# Altium schematic sheet Buffer.SchDoc: Buffer
size A4; Author: -; CompanyName: IOElectro; DrawnBy: Esmaeill M; Engineer: -; Organization: IOElectro; Address1: Bushehr,Iran; Address2: www.ioelectro.ir; DocumentNumber: 6; Revision: v0.3; SheetNumber: 6; SheetTotal: 6; ProjectNumber: 1013; Note: Buffer
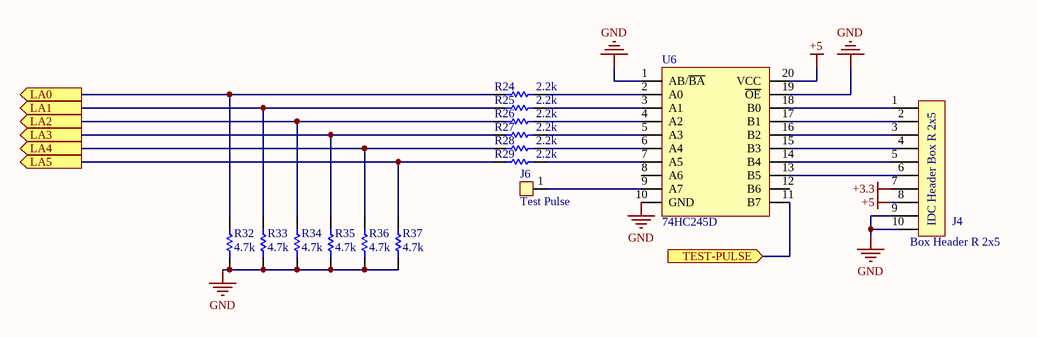
[diagram p0: Buffer.SchDoc]

## Parts
J4  Box Header R 2x5  [HB-R-10]
J6  Test Pulse  [PH-1X1-N3D]
R24  2.2k  [R-0805]
R25  2.2k  [R-0805]
R26  2.2k  [R-0805]
R27  2.2k  [R-0805]
R28  2.2k  [R-0805]
R29  2.2k  [R-0805]
R32  4.7k  [R-0805]
R33  4.7k  [R-0805]
R34  4.7k  [R-0805]
R35  4.7k  [R-0805]
R36  4.7k  [R-0805]
R37  4.7k  [R-0805]
U6  74HC245D  [SOW-20]

## Ports
LA0 (out), LA1 (out), LA2 (out), LA3 (out), LA4 (out), LA5 (out), TEST-PULSE (in)

## Nets
+3.3: J4.7
+5: J4.8 U6.20(VCC)
GND: J4.9 J4.10 R32.2 R33.2 R34.2 R35.2 R36.2 R37.2 U6.1(AB/~{BA}) U6.10(GND) U6.19(~{OE})
LA0: R24.2 R32.1 ; port LA0
LA1: R25.2 R33.1 ; port LA1
LA2: R26.2 R34.1 ; port LA2
LA3: R27.2 R35.1 ; port LA3
LA4: R28.2 R36.1 ; port LA4
LA5: R29.2 R37.1 ; port LA5
TEST-PULSE: U6.11(B7) ; port TEST-PULSE
NetJ4_1: J4.1 U6.18(B0)
NetJ4_2: J4.2 U6.17(B1)
NetJ4_3: J4.3 U6.16(B2)
NetJ4_4: J4.4 U6.15(B3)
NetJ4_5: J4.5 U6.14(B4)
NetJ4_6: J4.6 U6.13(B5)
NetJ6_1: J6.1 U6.9(A7)
NetR24_1: R24.1 U6.2(A0)
NetR25_1: R25.1 U6.3(A1)
NetR26_1: R26.1 U6.4(A2)
NetR27_1: R27.1 U6.5(A3)
NetR28_1: R28.1 U6.6(A4)
NetR29_1: R29.1 U6.7(A5)

Not connected (* = marked no-connect by the designer): U6 8(A6) 12(B6)

## Notes on the sheet
- Title
- Size:
- Date:
- A4
- Project Number:
- Time:
- Revision:
- Sheet
- of
- Drawn By:
- IOElectro
- File:
- Note:
- (in symbol DS1013-10R) IDC Header Box R 2x5

## Library data of the parts
J4 = DS1013-10R: IDC BOX HEADER RIGHT 2x5 , 2.54MM , 10 Position
J6 = PH-1X1: PIN HEADER 1x1 2.56mm
R24-R29 R32-R37 = RES: 0805
U6 = 74HC245D: 74HC Series 6V Surface Mount 3-State Octal Bus Transceiver - SOIC-20; Manufacturer: Nexperia; Manufacturer Part Number: 74HC245D,653; Supplier 1: Mouser; RoHS: Yes; Category: Buffers, Drivers and Transceivers; Stock 1: 690; Pricing 1: 1=0/60000, 10=0/49300, 50=0/49300, 100=0/38100, 1000=0/25100, 10000=0/24300 (USD); RoHS Compliant: Yes; ComponentLink1URL: http://www.farnell.com/datasheets/2030231.pdf?src-supplier=Farnell; ComponentLink1Description: http://www.farnell.com/datasheets/2030231.pdf?src-supplier=Farnell; Supplier Part Number 1: 771-74HC245D-T